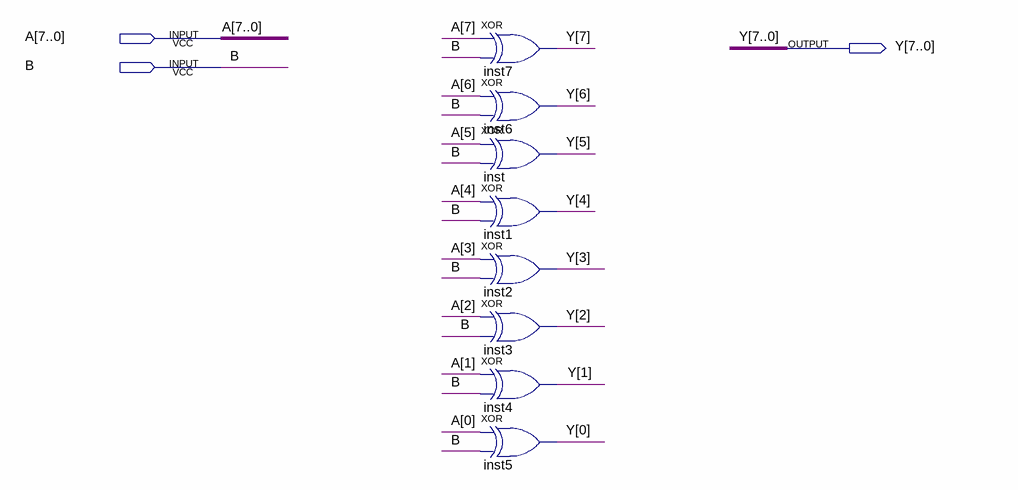
[diagram p0: schematic sheet]
// Quartus schematic Xor8bit.bdf as structural Verilog: 8 symbols, 3 pins
module Xor8bit (
  input  [7:0] A,
  input  B,
  output [7:0] Y
);

  xor inst7 (Y[7], A[7], B);
  xor inst6 (Y[6], A[6], B);
  xor inst (Y[5], A[5], B);
  xor inst1 (Y[4], A[4], B);
  xor inst2 (Y[3], A[3], B);
  xor inst3 (Y[2], A[2], B);
  xor inst4 (Y[1], A[1], B);
  xor inst5 (Y[0], A[0], B);
endmodule
